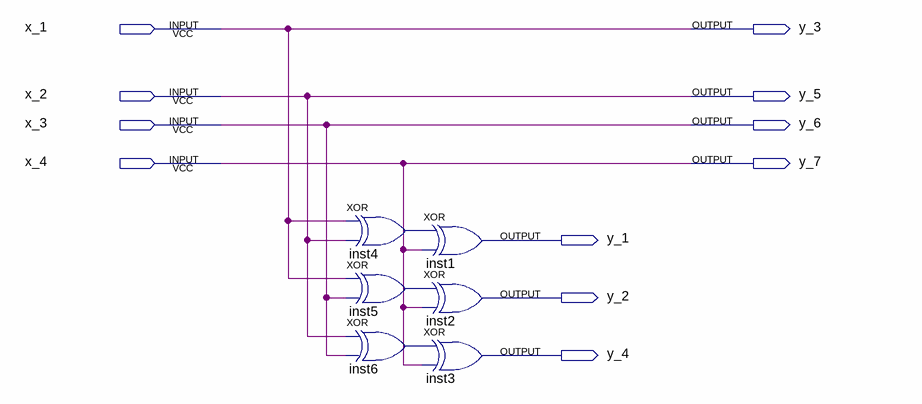
[diagram p0: schematic sheet]
// Quartus schematic coding_H.bdf as structural Verilog: 6 symbols, 11 pins
module coding_H (
  input  x_1,
  input  x_2,
  input  x_3,
  input  x_4,
  output y_3,
  output y_5,
  output y_6,
  output y_7,
  output y_1,
  output y_2,
  output y_4
);

  wire inst4_out, inst5_out, inst6_out;

  xor inst4 (inst4_out, x_1, x_2);
  xor inst5 (inst5_out, x_1, x_3);
  xor inst6 (inst6_out, x_2, x_3);
  xor inst1 (y_1, inst4_out, x_4);
  xor inst2 (y_2, inst5_out, x_4);
  xor inst3 (y_4, inst6_out, x_4);

  assign y_3 = x_1;
  assign y_5 = x_2;
  assign y_6 = x_3;
  assign y_7 = x_4;
endmodule
